# EAGLE design fabduck_01 (EAGLE 7.3.0)
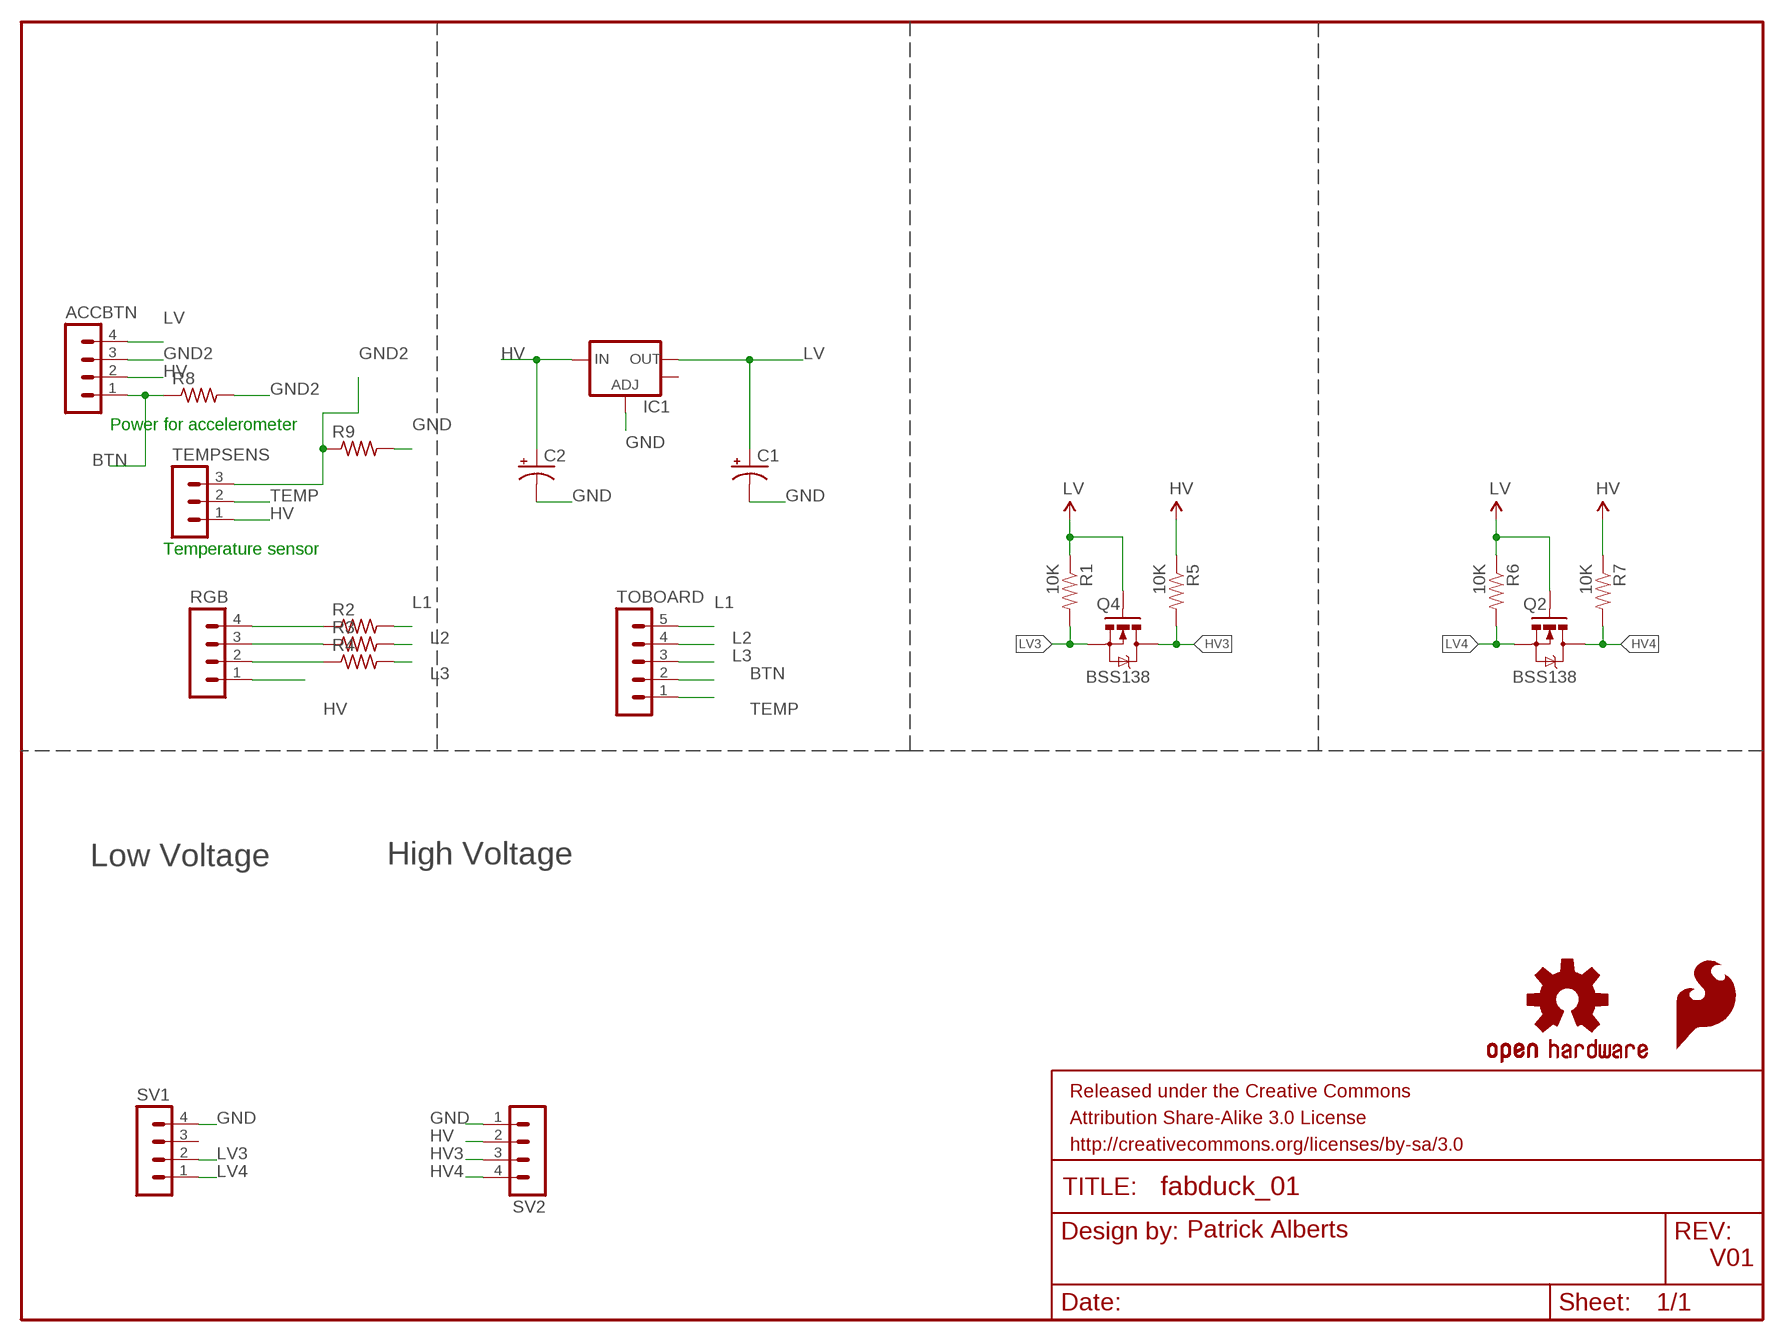
[diagram p0: schematic, sheet 1]

## Parts
ACCBTN  MA04-1  [MA04-1]
C1  CAP_POLD  [PANASONIC_D]
C2  CAP_POLD  [PANASONIC_D]
IC1  V_REG_LM1117SOT223  [SOT223]
LOGO1  SFE_LOGO_FLAME.1_INCH  [SFE_LOGO_FLAME_.1]
LOGO2  OSHW-LOGOS  [OSHW-LOGO-S]
Q2  BSS138  MOSFET-NCHANNELSMD  [SOT23-3]
Q4  BSS138  MOSFET-NCHANNELSMD  [SOT23-3]
R1  10K  RESISTOR0603-RES  [0603-RES]
R2  RESISTOR1206  [1206]
R3  RESISTOR1206  [1206]
R4  RESISTOR1206  [1206]
R5  10K  RESISTOR0603-RES  [0603-RES]
R6  10K  RESISTOR0603-RES  [0603-RES]
R7  10K  RESISTOR0603-RES  [0603-RES]
R8  RESISTOR1206  [1206]
R9  RESISTOR1206  [1206]
RGB  MA04-1  [MA04-1]
SV1  MA04-1  [MA04-1]
SV2  MA04-1  [MA04-1]
TEMPSENS  MA03-1  [MA03-1]
TOBOARD  MA05-1  [MA05-1]

## Nets
BTN: ACCBTN.1 R8.1 TOBOARD.2
GND: C1.- C2.- IC1.1(ADJ) R9.2 SV1.4 SV2.1
GND2: ACCBTN.3 R8.2 R9.1 TEMPSENS.3
HV: ACCBTN.2 C2.+ IC1.3(IN) R5.1 R7.1 RGB.1 SV2.2 TEMPSENS.1
HV3: Q4.3(D) R5.2 SV2.3
HV4: Q2.3(D) R7.2 SV2.4
L1: R2.2 TOBOARD.5
L2: R3.2 TOBOARD.4
L3: R4.2 TOBOARD.3
LV: ACCBTN.4 C1.+ IC1.2(OUT) Q2.1(G) Q4.1(G) R1.1 R6.1
LV3: Q4.2(S) R1.2 SV1.2
LV4: Q2.2(S) R6.2 SV1.1
N$1: R3.1 RGB.3
N$2: R4.1 RGB.2
N$4: R2.1 RGB.4
TEMP: TEMPSENS.2 TOBOARD.1
Unconnected: IC1.4(OUT) SV1.3

## Notes on the sheet
- Power for accelerometer
- Temperature sensor
- Low Voltage | High Voltage
- Patrick Alberts
- V01

## Library data of the parts
ACCBTN RGB SV1 SV2 = con-lstb:MA04-1: PIN HEADER; OC_FARNELL: unknown; OC_NEWARK: unknown
C1 C2 = 01_SparkFun:CAP_POL: Capacitor Polarized These are standard SMD and PTH capacitors. Normally 10uF, 47uF, and 100uF in electrolytic and tantalum varieties. Always verify the external diameter of the through hole cap, it varies with capacity, voltage, and manufacturer. The EIA devices should be standard.
IC1 = 01_SparkFun:V_REG_LM1117: Voltage Regulator LM1117 Standard adjustable voltage regulator but in SMD form. Spark Fun Electronics SKU : COM-00595
LOGO1 = SparkFun-Aesthetics:SFE_LOGO_FLAME: SFE Logo, flame only This is the SparkFun flame logo. The logo on the schematic will always be the same size; the package variant is the height of the flame. Default layer for the logo on the board is tSilk.
LOGO2 = SparkFun-Aesthetics:OSHW-LOGO: Open Source Hardware Logo This logo indicates the piece of hardware it is found on incorporates a OSHW license and/or adheres to the definition of open source hardware found here: http://freedomdefined.org/OSHW
Q2 Q4 = SparkFun:MOSFET-NCHANNEL
R1 R5-R7 = SparkFun:RESISTOR: Resistor Basic schematic elements and footprints for 0603, 1206, and PTH resistors.
R2-R4 R8 R9 = 01_FAB_Hello:RESISTOR
TEMPSENS = con-lstb:MA03-1: PIN HEADER; OC_FARNELL: unknown; OC_NEWARK: unknown
TOBOARD = con-lstb:MA05-1: PIN HEADER; OC_FARNELL: unknown; OC_NEWARK: unknown

## Board
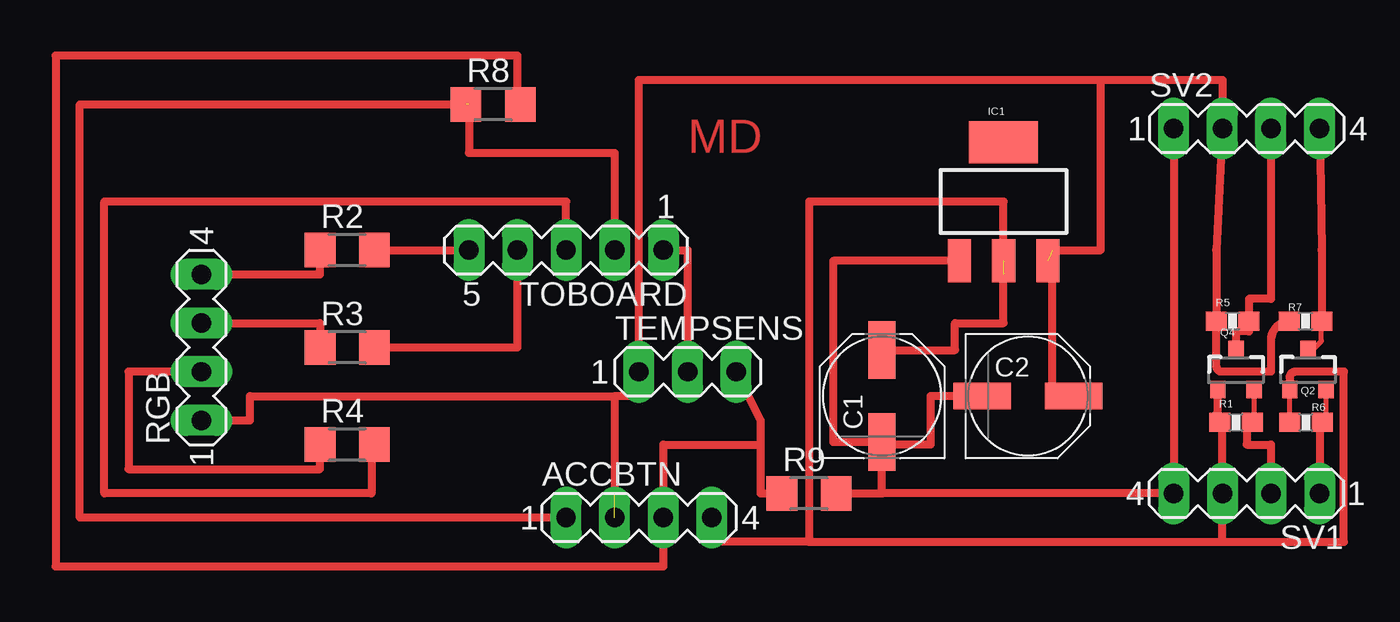
[diagram p1: board, top side]
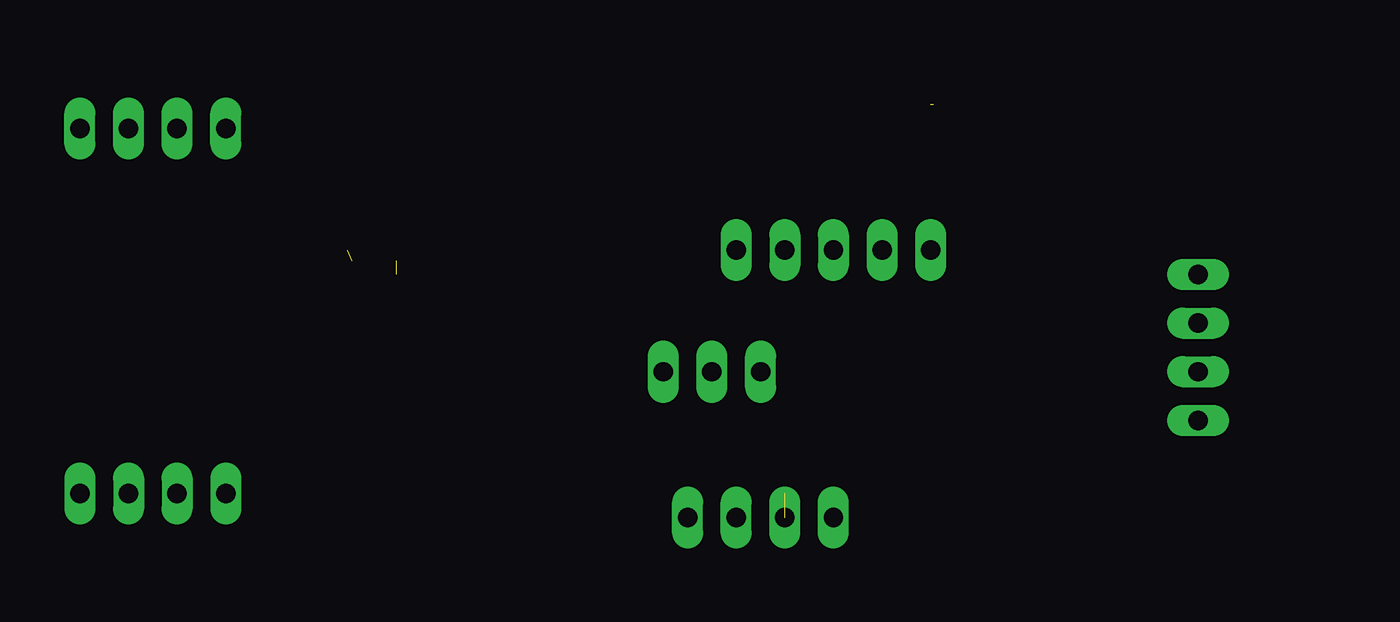
[diagram p2: board, bottom side, seen from below]

No outline drawn. Coordinates in mm, seen from the top.
Copper layers (1*16): Top 0.035mm / dielectric 1.5mm / Bottom 0.035mm
Design rules "SparkFun *": minimum track width 7mil, minimum drill 15mil, track to track 8mil, track to pad 8mil, pad to pad 8mil, via to via 8mil, smd to smd 8mil, copper to edge 8mil, drill to drill 8mil, minimum pad ring 12mil, minimum via ring 10mil, stop-mask expansion 4mil, vias tented up to drill 20mil, thermal gap 10mil

### Footprints (pad centres in the part's own frame; a part is rotated, then mirrored left to right if it is on the bottom)
MA04-1 = drill 1.016 long: 1 -3.81,0; 2 -1.27,0; 3 1.27,0; 4 3.81,0
PANASONIC_D = smd 3 x 1.4: + 2.4,0; - -2.4,0
SOT223 = smd 1.219 x 2.235: 1 -2.311,-3.099; 2 0,-3.099; 3 2.311,-3.099 | smd 3.6 x 2.2: 4 0,3.099
SOT23-3 = smd 0.8 x 0.9: 1 -0.95,-1; 2 0.95,-1; 3 0,1.1
0603-RES = smd 1.1 x 1: 1 -0.85,0; 2 0.85,0
1206 = smd 1.6 x 1.803: 1 -1.422,0; 2 1.422,0
MA03-1 = drill 1.016 long: 1 -2.54,0; 2 0,0; 3 2.54,0
MA05-1 = drill 1.016 long: 1 -5.08,0; 2 -2.54,0; 3 0,0; 4 2.54,0; 5 5.08,0

### Placement (x,y rotation side)
ACCBTN  22.86,16.51 0 top
C1  35.56,22.86 90 top
C2  43.18,22.86 0 top
IC1  41.91,33.02 0 top
LOGO1  5.21,4.83 0 bottom
LOGO2  1.78,6.6 270 bottom
Q2  57.81,24.21 0 top
Q4  54.05,24.21 0 top
R1  54.05,21.49 0 top
R2  7.62,30.48 0 top
R3  7.62,25.4 0 top
R4  7.62,20.32 0 top
R5  53.87,26.77 0 top
R6  57.71,21.49 0 top
R7  57.68,26.77 0 top
R8  15.24,38.1 0 top
R9  31.75,17.78 0 top
RGB  0,25.4 90 top
SV1  54.61,17.78 180 top
SV2  54.61,36.83 0 top
TEMPSENS  25.4,24.13 0 top
TOBOARD  19.05,30.48 180 top

### Tracks (layer width: path | path; a pad name or v marks a point on that pad's centre or on a via)
BTN  (1 unrouted)
  Top 0.406: ACCBTN.1 -6.35,16.51 -6.35,38.1 13.97,38.1 13.97,35.56 21.59,35.56 TOBOARD.2
GND
  Top 0.406: SV2.1 SV1.4 35.56,17.78 | 35.56,17.78 C1.- | C1.- 33.02,20.46 33.02,29.92 IC1.1 | C2.- 38.1,22.86 38.1,20.32 35.56,20.32 C1.- | R9.2 35.56,17.78
GND2
  Top 0.406: TEMPSENS.3 29.21,21.59 29.21,20.32 | 29.21,20.32 29.21,17.78 R9.1 | 29.21,20.32 24.13,20.32 ACCBTN.3 24.13,13.97 -7.62,13.97 -7.62,40.64 16.51,40.64 16.51,38.1 R8.2
HV  (2 unrouted)
  Top 0.406: C2.+ 44.45,22.86 44.45,30.48 46.99,30.48 46.99,39.37 | 46.99,39.37 53.34,39.37 SV2.2 53.02,30.48 R5.1 53.02,24.45 arc90 53.34,24.13 55.88,24.13 55.88,25.77 arc-90 56.88,26.77 | 46.99,39.37 22.86,39.37 TEMPSENS.1 22.86,22.86 21.59,22.86 | RGB.1 2.54,21.59 2.54,22.86 21.59,22.86 | 21.59,22.86 21.59,17.78 | R7.1 56.88,26.77 | 57.15,26.77 56.88,26.77
HV3
  Top 0.254: 54.72,26.23 R5.2 | Q4.3 54.05,25.56
  Top 0.406: SV2.3 55.88,27.94 54.72,27.94 R5.2 | 54.72,26.23 54.05,26.23 Q4.3
HV4
  Top 0.254: Q2.3 58.1,25.31 58.52,25.73 R7.2 58.42,26.89
  Top 0.406: SV2.4 58.53,30.48 R7.2
L1
  Top 0.406: R2.2 TOBOARD.5
L2
  Top 0.406: R3.2 16.51,25.4 TOBOARD.4
L3
  Top 0.406: R4.2 8.89,20.32 8.89,17.78 -5.08,17.78 -5.08,33.02 19.05,33.02 TOBOARD.3
LV  (1 unrouted)
  Top 0.254: 53.2,21.27 R1.1 52.85,21.84 53.1,22.1 Q4.1 | 56.63,23.21 Q2.1 56.86,21.74 56.73,21.61 R6.1
  Top 0.406: 53.2,21.27 53.34,21.27 | 35.56,24.13 C1.+ 39.37,25.26 39.37,26.67 41.91,26.67 41.91,29.21 | IC1.2 41.91,33.02 31.75,33.02 31.75,15.24 | 31.75,15.24 53.34,15.24 | 53.34,15.24 53.34,21.59 53.1,21.59 Q4.1 | 56.73,21.61 57.15,21.61 | 31.75,15.24 26.67,15.24 ACCBTN.4 | Q2.1 56.86,23.84 arc-90 57.15,24.13 59.69,24.13 59.69,15.24 53.34,15.24
LV3
  Top 0.254: R1.2 54.75,21.64 55,21.9 Q4.2
  Top 0.406: R1.2 54.61,21.49 54.61,20.32 55.88,20.32 SV1.2
LV4
  Top 0.254: R6.2 58.76,21.69 Q2.2
  Top 0.406: R6.2 58.42,21.49 SV1.1
N$1
  Top 0.406: RGB.3 6.2,26.67 R3.1
N$2
  Top 0.406: RGB.2 -3.81,24.13 -3.81,19.05 6.2,19.05 R4.1
N$4
  Top 0.406: RGB.4 6.2,29.21 R2.1
TEMP
  Top 0.406: TOBOARD.1 25.4,30.48 TEMPSENS.2

### Text on the board
Top: MD
tPlace: HV1 | HV2 | HV | GND | HV3 | HV4 | LV1 | LV2 | LV | GND | LV3 | LV4
bPlace: HV1 | HV2 | Level / Converter | HV | GND | HV3 | HV4 | LV1 | LV2 | LV | GND | LV3 | LV4
tValues: Nathan Seidle | Rev V13 by Patrick Alberts